# EAGLE design Slider (EAGLE 8.6.0)
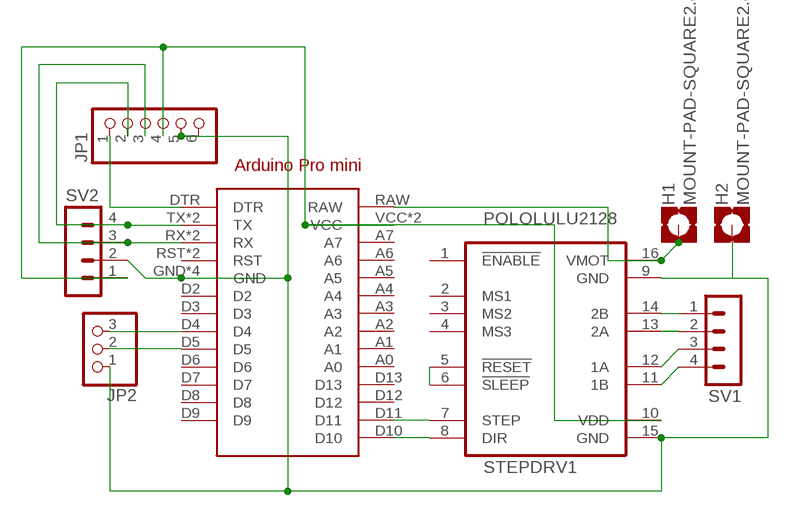
[diagram p0: schematic, sheet 1]

## Parts
ARDUINO1  ARDUINO_PRO_MINI  [ARDUINO_PRO_MINI]
H1  MOUNT-PAD-SQUARE2.8  [2,8-PAD-SQUARE]
H2  MOUNT-PAD-SQUARE2.8  [2,8-PAD-SQUARE]
JP1  PINHD-1X6  [1X06]
JP2  PINHD-1X3CB  [1X03-CLEANBIG]
STEPDRV1  POLOLULU2128  [POLOLULU2128]
SV1  MA04-1  [MA04-1]
SV2  MA04-1  [MA04-1]

## Nets
N$1: ARDUINO1.D11 STEPDRV1.7(STEP)
N$2: ARDUINO1.D10 STEPDRV1.8(DIR)
N$3: STEPDRV1.5(!RESET) STEPDRV1.6(!SLEEP)
N$4: STEPDRV1.11(1B) SV1.4
N$5: STEPDRV1.12(1A) SV1.3
N$6: STEPDRV1.13(2A) SV1.2
N$7: STEPDRV1.14(2B) SV1.1
N$8: ARDUINO1.RAW H1.B2,8(MOUNT) STEPDRV1.16(VMOT)
N$9: ARDUINO1.VCC ARDUINO1.VCC@1(VCC) JP1.4 STEPDRV1.10(VDD) SV2.1
N$10: ARDUINO1.GND ARDUINO1.GND@1(GND) ARDUINO1.GND@2(GND) ARDUINO1.GND@3(GND) H2.B2,8(MOUNT) JP1.5 JP1.6 JP2.1 STEPDRV1.9(GND) STEPDRV1.15(GND) SV2.2
N$11: ARDUINO1.DTR JP1.1
N$13: ARDUINO1.RX ARDUINO1.RX@1(RX) JP1.3 SV2.3
N$14: ARDUINO1.TX ARDUINO1.TX@1(TX) JP1.2 SV2.4
N$18: ARDUINO1.D4 JP2.3
N$19: ARDUINO1.D5 JP2.2
Unconnected: ARDUINO1.A0 ARDUINO1.A1 ARDUINO1.A2 ARDUINO1.A3 ARDUINO1.A4 ARDUINO1.A5 ARDUINO1.A6 ARDUINO1.A7 ARDUINO1.D2 ARDUINO1.D3 ARDUINO1.D6 ARDUINO1.D7 ARDUINO1.D8 ARDUINO1.D9 ARDUINO1.D12 ARDUINO1.D13 ARDUINO1.RST ARDUINO1.RST@1(RST) STEPDRV1.1(!ENABLE) STEPDRV1.2(MS1) STEPDRV1.3(MS2) STEPDRV1.4(MS3)

## Library data of the parts
ARDUINO1 = arduinopromini:ARDUINO_PRO_MINI: For creating Arduino Pro Mini shields
H1 H2 = holes:MOUNT-PAD-SQUARE: MOUNTING PAD, square
JP1 = adafruit:PINHD-1X6: PIN HEADER
JP2 = adafruit:PINHD-1X3: PIN HEADER
STEPDRV1 = stepper_drivers_etc:POLOLULU2128
SV1 SV2 = con-lstb:MA04-1: PIN HEADER; OC_FARNELL: unknown; OC_NEWARK: unknown

## Board
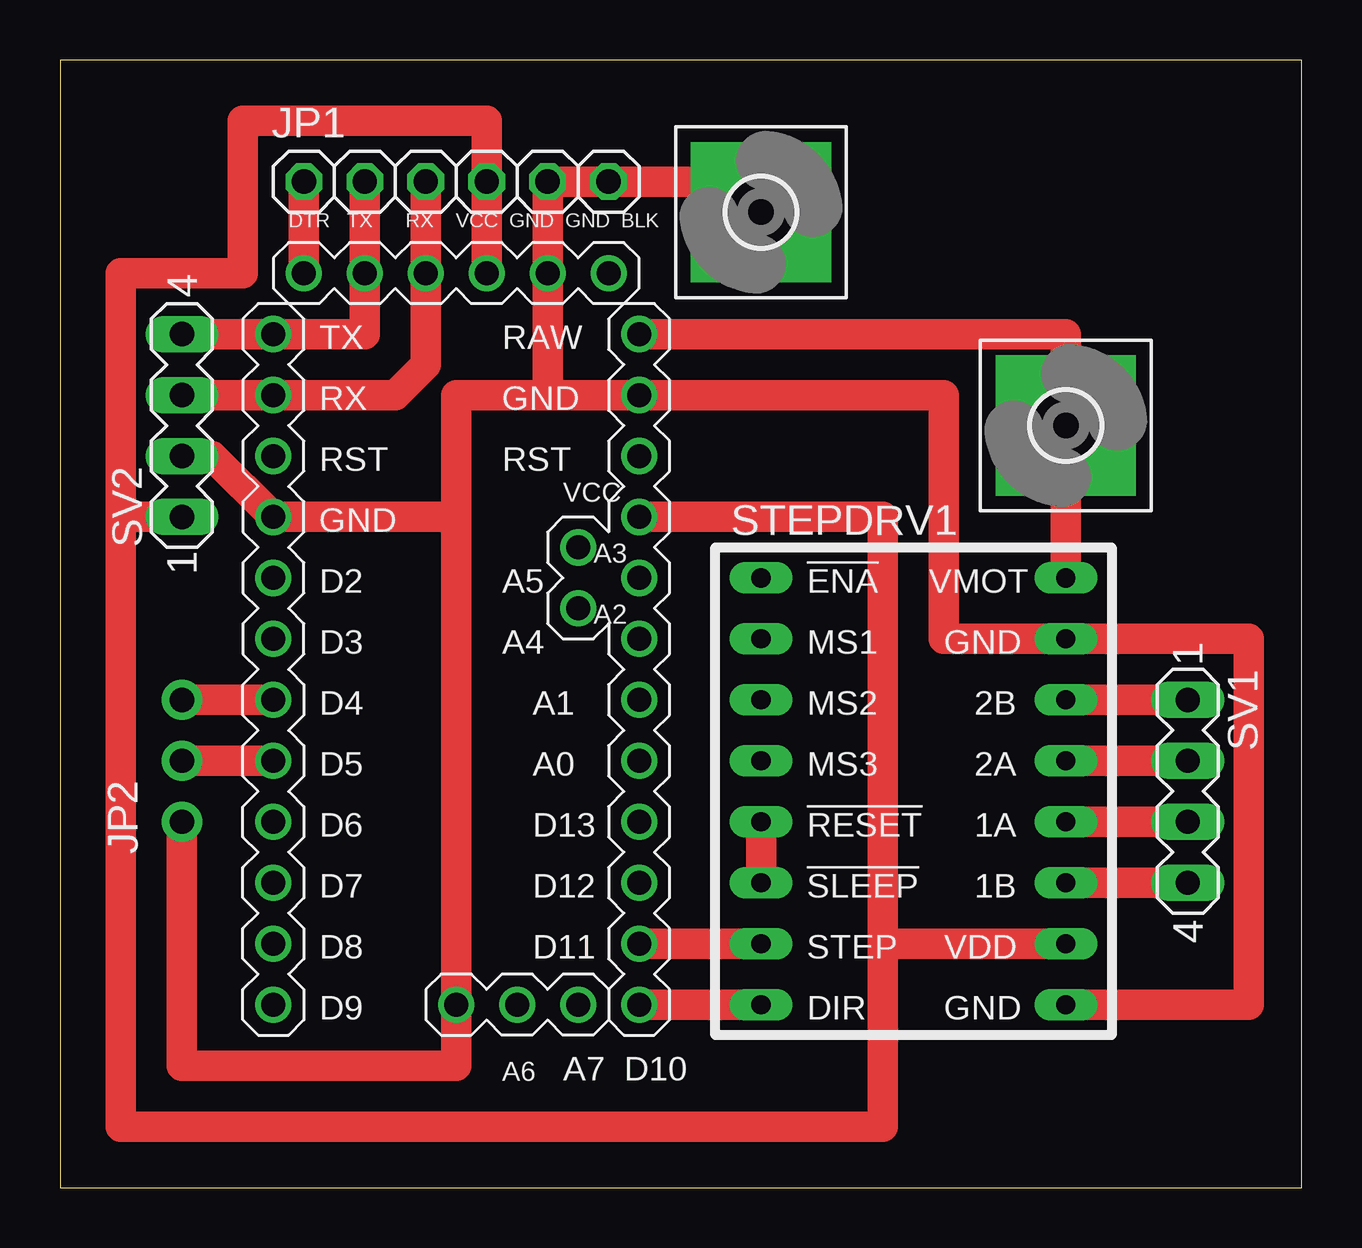
[diagram p1: board, top side]

Size 51.74 x 46.98 mm. Coordinates in mm from the lower left corner, seen from the top.
Outline: 0,0 51.74,0 51.74,46.98 0,46.98 0,0
Copper layers (1*16): Top 0.035mm / dielectric 1.5mm / Bottom 0.035mm
Design rules "default": minimum track width 6mil, minimum drill 0.35mm, track to track 6mil, track to pad 6mil, pad to pad 6mil, via to via 6mil, smd to smd 6mil, copper to edge 40mil, drill to drill 6mil, minimum pad ring 10mil, minimum via ring 8mil, stop-mask expansion 4mil, vias tented up to drill 0mil, thermal gap 10mil

### Footprints (pad centres in the part's own frame; a part is rotated, then mirrored left to right if it is on the bottom)
ARDUINO_PRO_MINI = drill 1: A0 11.43,-8.89; A1 11.43,-6.35; A2 11.43,-3.81; A3 11.43,-1.27; A4 8.89,-2.54; A5 8.89,0; A6 6.35,-19.05; A7 8.89,-19.05; BLK 10.16,11.43; D2 -3.81,-1.27; D3 -3.81,-3.81; D4 -3.81,-6.35; D5 -3.81,-8.89; D6 -3.81,-11.43; D7 -3.81,-13.97; D8 -3.81,-16.51; D9 -3.81,-19.05; D10 11.43,-19.05; D11 11.43,-16.51; D12 11.43,-13.97; D13 11.43,-11.43; DTR -2.54,11.43; GND -3.81,1.27; GND@1 11.43,6.35; GND@2 7.62,11.43; GND@3 3.81,-19.05; RAW 11.43,8.89; RST 11.43,3.81; RST@1 -3.81,3.81; RX -3.81,6.35; RX@1 2.54,11.43; TX -3.81,8.89; TX@1 0,11.43; VCC 11.43,1.27; VCC@1 5.08,11.43
2,8-PAD-SQUARE = drill 2.8 pad 5.842 square: B2,8 0,0
1X06 = drill 1.016 octagon: 1 -6.35,0; 2 -3.81,0; 3 -1.27,0; 4 1.27,0; 5 3.81,0; 6 6.35,0
1X03-CLEANBIG = drill 1.016 pad 1.676: 1 -2.54,0; 2 0,0; 3 2.54,0
POLOLULU2128 = drill 0.8 long: 1 -7.62,7.62; 2 -7.62,5.08; 3 -7.62,2.54; 4 -7.62,0; 5 -7.62,-2.54; 6 -7.62,-5.08; 7 -7.62,-7.62; 8 -7.62,-10.16; 9 5.08,-10.16; 10 5.08,-7.62; 11 5.08,-5.08; 12 5.08,-2.54; 13 5.08,0; 14 5.08,2.54; 15 5.08,5.08; 16 5.08,7.62
MA04-1 = drill 1.016 long: 1 -3.81,0; 2 -1.27,0; 3 1.27,0; 4 3.81,0

### Placement (x,y rotation side)
ARDUINO1  12.7,26.67 0 top
H1  41.91,31.75 0 top
H2  29.21,40.64 180 top
JP1  16.51,41.91 0 top
JP2  5.08,17.78 90 top
STEPDRV1  36.83,17.78 0 top
SV1  46.99,16.51 270 top
SV2  5.08,31.75 90 top

### Tracks (layer width: path | path; a pad name or v marks a point on that pad's centre or on a via)
N$1
  Top 1.27: ARDUINO1.D11 STEPDRV1.7
N$2
  Top 1.27: STEPDRV1.8 ARDUINO1.D10
N$3
  Top 1.27: STEPDRV1.6 STEPDRV1.5
N$4
  Top 1.27: SV1.4 STEPDRV1.11
N$5
  Top 1.27: STEPDRV1.12 SV1.3
N$6
  Top 1.27: SV1.2 STEPDRV1.13
N$7
  Top 1.27: STEPDRV1.14 SV1.1
N$8
  Top 1.27: STEPDRV1.16 H1.B2,8 41.91,35.56 ARDUINO1.RAW
N$9
  Top 1.27: ARDUINO1.VCC 34.29,27.94 34.29,10.16 | 34.29,10.16 STEPDRV1.10 | 34.29,10.16 34.29,2.54 2.54,2.54 2.54,27.94 | 2.54,27.94 SV2.1 | ARDUINO1.VCC@1 JP1.4 17.78,44.45 7.62,44.45 7.62,38.1 2.54,38.1 2.54,27.94
N$10
  Top 1.27: STEPDRV1.9 49.53,7.62 49.53,22.86 STEPDRV1.15 36.83,22.86 36.83,33.02 ARDUINO1.GND@1 20.32,33.02 | JP2.1 5.08,5.08 16.51,5.08 ARDUINO1.GND@3 16.51,27.94 | SV2.2 6.35,30.48 ARDUINO1.GND 16.51,27.94 | 20.32,33.02 16.51,33.02 16.51,27.94 | 20.32,33.02 ARDUINO1.GND@2 JP1.5 JP1.6 29.21,41.91 H2.B2,8
N$11
  Top 1.27: ARDUINO1.DTR JP1.1
N$13
  Top 1.27: SV2.3 ARDUINO1.RX 13.97,33.02 15.24,34.29 ARDUINO1.RX@1 JP1.3
N$14
  Top 1.27: SV2.4 ARDUINO1.TX 12.7,35.56 ARDUINO1.TX@1 JP1.2
N$18
  Top 1.27: JP2.3 ARDUINO1.D4
N$19
  Top 1.27: ARDUINO1.D5 JP2.2